# EAGLE design W010X (EAGLE 6.6.0)
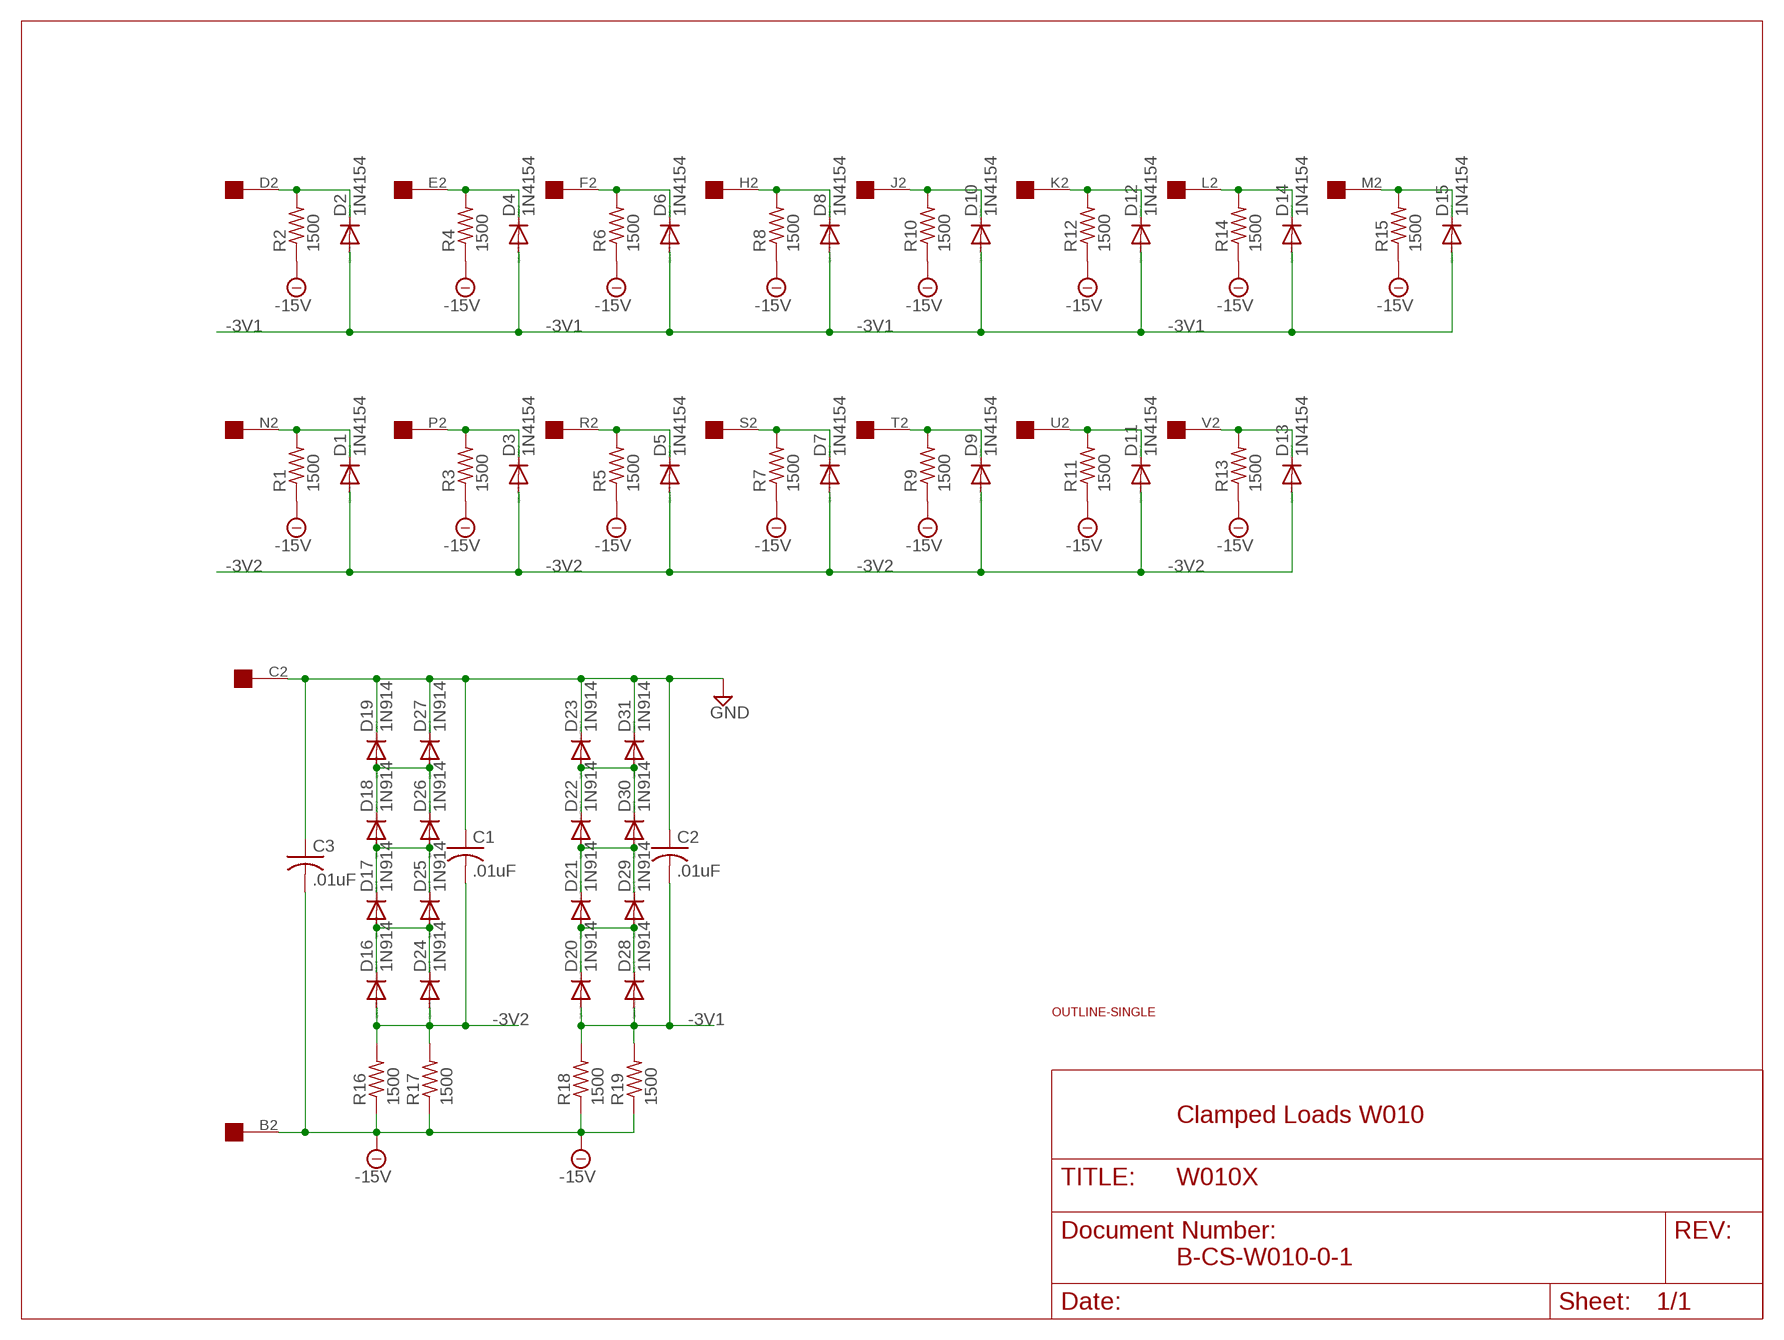
[diagram p0: schematic, sheet 1]

## Parts
C1  .01uF  C-US  [C063-025X075]
C2  .01uF  C-US  [C063-025X075]
C3  .01uF  C-US  [C063-025X075]
D1  1N4154  DIODE-DO35-10  [DO35-10]
D2  1N4154  DIODE-DO35-10  [DO35-10]
D3  1N4154  DIODE-DO35-10  [DO35-10]
D4  1N4154  DIODE-DO35-10  [DO35-10]
D5  1N4154  DIODE-DO35-10  [DO35-10]
D6  1N4154  DIODE-DO35-10  [DO35-10]
D7  1N4154  DIODE-DO35-10  [DO35-10]
D8  1N4154  DIODE-DO35-10  [DO35-10]
D9  1N4154  DIODE-DO35-10  [DO35-10]
D10  1N4154  DIODE-DO35-10  [DO35-10]
D11  1N4154  DIODE-DO35-10  [DO35-10]
D12  1N4154  DIODE-DO35-10  [DO35-10]
D13  1N4154  DIODE-DO35-10  [DO35-10]
D14  1N4154  DIODE-DO35-10  [DO35-10]
D15  1N4154  DIODE-DO35-10  [DO35-10]
D16  1N914  DIODE-DO35-10  [DO35-10]
D17  1N914  DIODE-DO35-10  [DO35-10]
D18  1N914  DIODE-DO35-10  [DO35-10]
D19  1N914  DIODE-DO35-10  [DO35-10]
D20  1N914  DIODE-DO35-10  [DO35-10]
D21  1N914  DIODE-DO35-10  [DO35-10]
D22  1N914  DIODE-DO35-10  [DO35-10]
D23  1N914  DIODE-DO35-10  [DO35-10]
D24  1N914  DIODE-DO35-10  [DO35-10]
D25  1N914  DIODE-DO35-10  [DO35-10]
D26  1N914  DIODE-DO35-10  [DO35-10]
D27  1N914  DIODE-DO35-10  [DO35-10]
D28  1N914  DIODE-DO35-10  [DO35-10]
D29  1N914  DIODE-DO35-10  [DO35-10]
D30  1N914  DIODE-DO35-10  [DO35-10]
D31  1N914  DIODE-DO35-10  [DO35-10]
R1  1500  R-US_0207/10  [0207/10]
R2  1500  R-US_0207/10  [0207/10]
R3  1500  R-US_0207/10  [0207/10]
R4  1500  R-US_0207/10  [0207/10]
R5  1500  R-US_0207/10  [0207/10]
R6  1500  R-US_0207/10  [0207/10]
R7  1500  R-US_0207/10  [0207/10]
R8  1500  R-US_0207/10  [0207/10]
R9  1500  R-US_0207/10  [0207/10]
R10  1500  R-US_0207/10  [0207/10]
R11  1500  R-US_0207/10  [0207/10]
R12  1500  R-US_0207/10  [0207/10]
R13  1500  R-US_0207/10  [0207/10]
R14  1500  R-US_0207/10  [0207/10]
R15  1500  R-US_0207/10  [0207/10]
R16  1500  R-US_0207/10  [0207/10]
R17  1500  R-US_0207/10  [0207/10]
R18  1500  R-US_0207/10  [0207/10]
R19  1500  R-US_0207/10  [0207/10]
U$1  EDGE-1  [EDGE-CON1]
U$2  OUTLINE-SINGLE  [SINGLE]

## Nets
-3V1: C2.2 D2.A D4.A D6.A D8.A D10.A D12.A D14.A D15.A D20.A D28.A R18.2 R19.2
-3V2: C1.2 D1.A D3.A D5.A D7.A D9.A D11.A D13.A D16.A D24.A R16.2 R17.2
-15V: C3.2 R1.1 R2.1 R3.1 R4.1 R5.1 R6.1 R7.1 R8.1 R9.1 R10.1 R11.1 R12.1 R13.1 R14.1 R15.1 R16.1 R17.1 R18.1 R19.1 U$1.B2
GND: C1.1 C2.1 C3.1 D19.C D23.C D27.C D31.C U$1.C2
N$1: D2.C R2.2 U$1.D2
N$2: D4.C R4.2 U$1.E2
N$3: D6.C R6.2 U$1.F2
N$4: D8.C R8.2 U$1.H2
N$5: D10.C R10.2 U$1.J2
N$6: D12.C R12.2 U$1.K2
N$7: D14.C R14.2 U$1.L2
N$8: D15.C R15.2 U$1.M2
N$9: D1.C R1.2 U$1.N2
N$10: D3.C R3.2 U$1.P2
N$11: D5.C R5.2 U$1.R2
N$12: D7.C R7.2 U$1.S2
N$13: D9.C R9.2 U$1.T2
N$14: D11.C R11.2 U$1.U2
N$15: D13.C R13.2 U$1.V2
N$16: D16.C D17.A D24.C D25.A
N$18: D17.C D18.A D25.C D26.A
N$19: D18.C D19.A D26.C D27.A
N$21: D20.C D21.A D28.C D29.A
N$22: D21.C D22.A D29.C D30.A
N$23: D22.C D23.A D30.C D31.A
Unconnected: U$1.A2

## Notes on the sheet
- Clamped Loads W010
- B-CS-W010-0-1

## Library data of the parts
C1-C3 = dec-con:C-US: Capacitors with funky DEC lead spacing.
D1-D31 = diode:DIODE-: DIODE
R1-R19 = rcl:R-US_: RESISTOR, American symbol
U$1 = dec-con:EDGE-1: Single-Sided DEC Edge Connector -- (side 2)
U$2 = dec-con:OUTLINE-*: Board outlines for DEC boards.

## Board
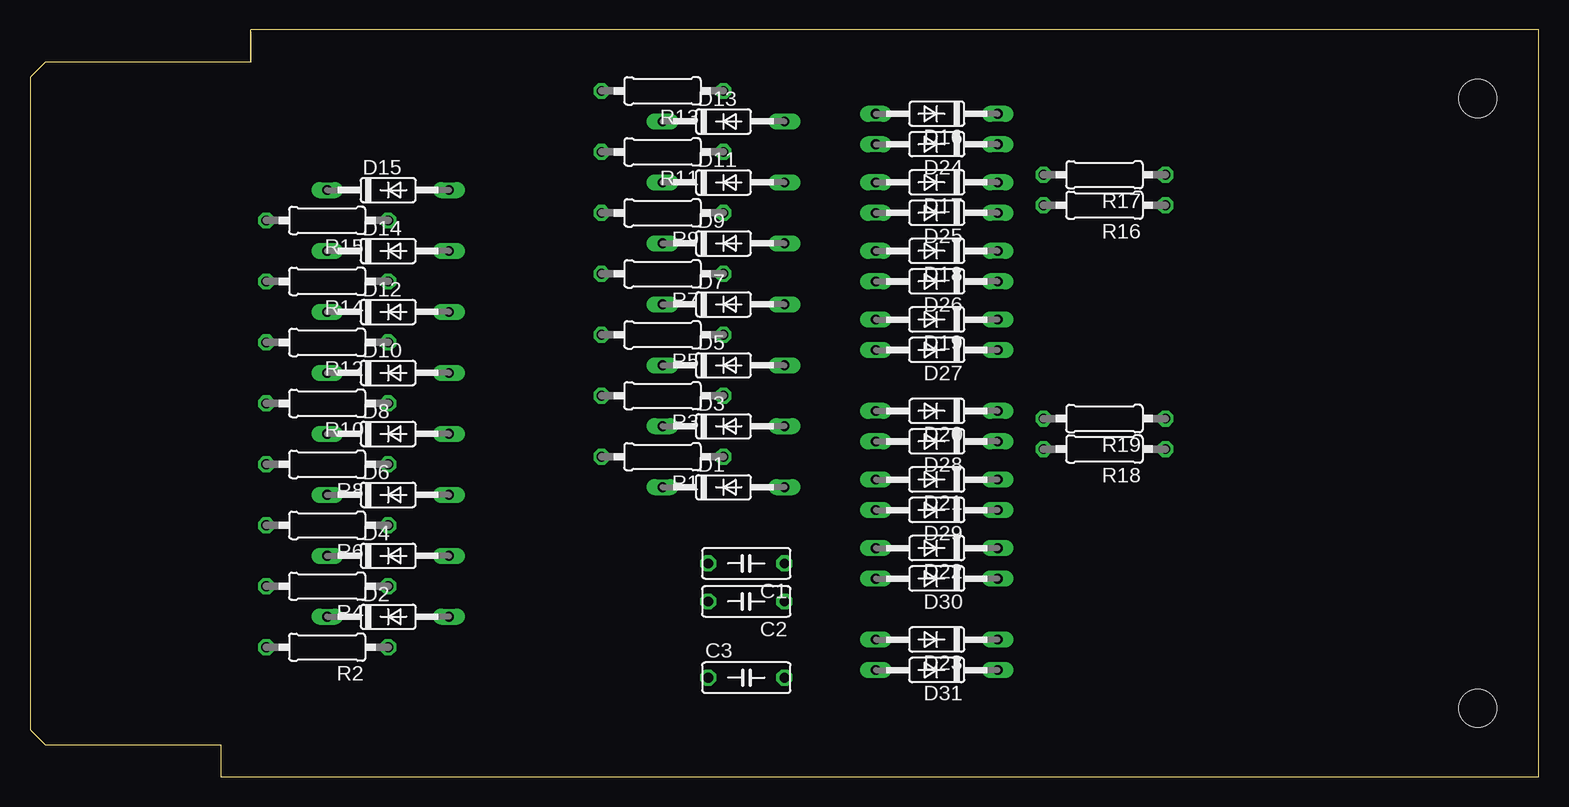
[diagram p1: board, top side]
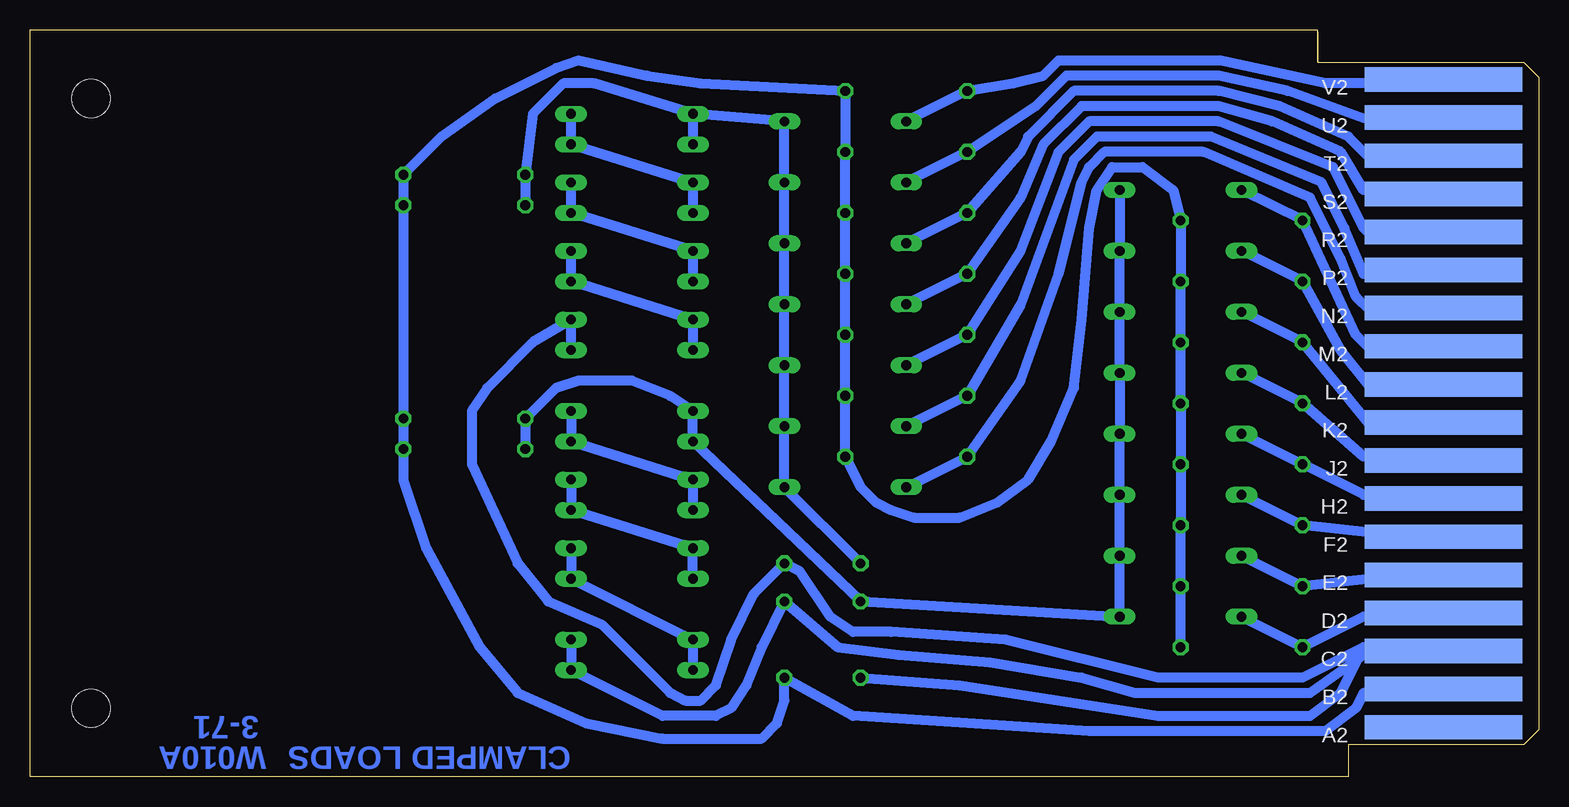
[diagram p2: board, bottom side, seen from below]

Size 125.73 x 62.23 mm. Coordinates in mm from the lower left corner, seen from the top.
Copper layers (1+16): Top 0.035mm / dielectric 1.5mm / Bottom 0.035mm
Design rules "16mils": minimum track width 16mil, minimum drill 32mil, track to track 15mil, track to pad 10mil, pad to pad 10mil, via to via 10mil, smd to smd 10mil, copper to edge 13mil, drill to drill 10mil, minimum pad ring 10mil, minimum via ring 8mil, stop-mask expansion 0mil, vias tented up to drill 0mil, thermal gap 10mil

### Footprints (pad centres in the part's own frame; a part is rotated, then mirrored left to right if it is on the bottom)
C063-025X075 = drill 0.813 octagon: 1 -2.54,0; 2 3.81,0
DO35-10 = drill 0.813 long: A 5.08,0; C -5.08,0
0207/10 = drill 0.813 octagon: 1 -5.08,0; 2 5.08,0
EDGE-CON1 = smd 13.106 x 2.032 bottom: A2 7.938,4.128; B2 7.938,7.303; C2 7.938,10.477; D2 7.938,13.652; E2 7.938,16.828; F2 7.938,20.003; H2 7.938,23.177; J2 7.938,26.352; K2 7.938,29.527; L2 7.938,32.703; M2 7.938,35.877; N2 7.938,39.053; P2 7.938,42.227; R2 7.938,45.403; S2 7.938,48.578; T2 7.938,51.752; U2 7.938,54.928; V2 7.938,58.102
SINGLE = hole 3.175: 120.65,56.515; 120.65,5.715

### Placement (x,y rotation side)
C1  60.33,17.78 180 top
C2  60.33,14.61 180 top
C3  59.06,8.26 0 top
D1  57.79,24.13 0 top
D2  29.85,13.34 0 top
D3  57.79,29.21 0 top
D4  29.85,18.41 0 top
D5  57.79,34.29 0 top
D6  29.85,23.5 0 top
D7  57.79,39.37 0 top
D8  29.85,28.57 0 top
D9  57.79,44.45 0 top
D10  29.85,33.66 0 top
D11  57.79,49.53 0 top
D12  29.85,38.73 0 top
D13  57.79,54.61 0 top
D14  29.85,43.81 0 top
D15  29.85,48.9 0 top
D16  75.57,55.24 180 top
D17  75.57,49.53 180 top
D18  75.57,43.81 180 top
D19  75.57,38.1 180 top
D20  75.57,30.48 180 top
D21  75.57,24.77 180 top
D22  75.57,19.05 180 top
D23  75.57,11.43 180 top
D24  75.57,52.7 180 top
D25  75.57,46.99 180 top
D26  75.57,41.27 180 top
D27  75.57,35.56 180 top
D28  75.57,27.94 180 top
D29  75.57,22.23 180 top
D30  75.57,16.51 180 top
D31  75.57,8.89 180 top
R1  52.71,26.67 180 top
R2  24.77,10.79 180 top
R3  52.71,31.75 180 top
R4  24.77,15.88 180 top
R5  52.71,36.83 180 top
R6  24.77,20.95 180 top
R7  52.71,41.91 180 top
R8  24.77,26.04 180 top
R9  52.71,46.99 180 top
R10  24.77,31.11 180 top
R11  52.71,52.07 180 top
R12  24.77,36.2 180 top
R13  52.71,57.15 180 top
R14  24.77,41.27 180 top
R15  24.77,46.35 180 top
R16  89.54,47.62 180 top
R17  89.54,50.16 180 top
R18  89.54,27.3 180 top
R19  89.54,29.84 180 top
U$1  0,0 0 top
U$2  0,0 0 top

### Tracks (layer width: path | path; a pad name or v marks a point on that pad's centre or on a via)
-3V1
  Bottom 0.813: D15.A D14.A D12.A D10.A D8.A D6.A D4.A D2.A C2.2 D28.A D20.A 72.39,31.75 75.57,33.02 80.01,33.02 81.92,32.38 R19.2 R18.2
-3V2
  Bottom 0.813: C1.2 D1.A D3.A D5.A D7.A D9.A D11.A D13.A D16.A | D16.A 78.74,57.78 81.28,57.78 83.82,55.24 R17.2 R16.2 | D16.A D24.A
-15V
  Bottom 0.813: R2.1 R4.1 R6.1 R8.1 R10.1 R12.1 R14.1 R15.1 30.48,48.9 33.02,50.8 35.56,50.8 36.83,48.9 37.47,45.72 38.1,38.1 38.74,32.38 40.64,27.94 42.55,24.77 45.09,22.86 48.26,21.59 52.07,21.59 53.98,22.23 55.25,22.86 56.52,24.13 R1.1 R3.1 R5.1 R7.1 R9.1 R11.1 R13.1 69.85,57.78 74.3,58.42 80.01,59.69 81.92,59.05 87,56.52 91.44,53.34 R17.1 R16.1 R19.1 R18.1 94.62,24.77 92.71,19.05 88.27,10.79 85.09,6.99 79.38,4.45 73.03,3.17 64.77,3.17 63.5,4.45 62.87,6.35 C3.2 57.15,5.08 37.47,3.81 17.78,3.81 15.24,5.71 14.61,6.99 8.89,6.99 U$1.B2
GND
  Bottom 0.813: D23.C D31.C 73.03,5.08 68.58,5.08 67.31,5.71 66.04,7.62 64.77,10.79 C2.1 58.42,10.79 53.34,10.16 45.72,9.53 38.1,8.26 33.66,6.99 19.05,6.99 14.61,10.16 10.16,10.79 | U$1.C2 8.89,10.79 10.16,10.79 | 10.16,10.79 14.61,10.79 | 14.61,10.79 19.69,8.26 31.75,8.26 44.45,11.43 53.98,12.06 57.15,12.06 59.06,13.34 61.6,17.14 C1.1 65.41,15.24 67.31,11.43 68.58,7.62 69.85,6.35 71.12,6.35 72.39,6.99 78.11,12.7 82.55,14.61 85.09,17.78 88.9,26.04 88.9,30.48 87.63,32.38 83.82,36.2 D19.C D27.C | C3.1 48.26,7.62 31.75,5.08 19.05,5.08 16.51,6.99 14.61,10.79
N$1
  Bottom 0.813: U$1.D2 14.61,13.34 R2.2 D2.C
N$2
  Bottom 0.813: D4.C R4.2 13.97,16.51 10.16,16.51 U$1.E2
N$3
  Bottom 0.813: D6.C R6.2 13.97,20.32 U$1.F2
N$4
  Bottom 0.813: D8.C R8.2 14.61,23.5 U$1.H2
N$5
  Bottom 0.813: U$1.J2 8.89,26.67 14.61,26.67 R10.2 D10.C
N$6
  Bottom 0.813: U$1.K2 8.89,29.21 13.97,29.21 R12.2 D12.C
N$7
  Bottom 0.813: U$1.L2 9.53,32.38 13.97,32.38 16.51,35.56 R14.2 D14.C
N$8
  Bottom 0.813: D15.C R15.2 15.24,36.83 13.97,35.56 8.89,35.56 U$1.M2
N$9
  Bottom 0.813: D1.C R1.2 43.18,33.02 40.01,41.91 38.1,49.53 37.47,50.8 36.2,52.07 27.94,52.07 19.05,48.26 16.51,43.18 15.24,40.01 13.97,38.73 9.53,38.73 U$1.N2
N$10
  Bottom 0.813: D3.C R3.2 43.18,39.37 38.74,51.44 36.83,53.34 27.31,53.34 18.1,49.53 16.19,45.72 14.61,41.91 8.89,41.91 U$1.P2
N$11
  Bottom 0.813: D5.C R5.2 43.18,43.81 40.01,52.07 37.47,54.61 26.67,54.61 17.15,50.8 14.61,45.72 13.97,45.09 10.16,45.09 U$1.R2
N$12
  Bottom 0.813: D7.C R7.2 43.18,48.26 41.28,52.7 38.1,55.88 26.67,55.88 22.23,54.61 16.51,52.07 14.61,48.9 8.89,48.9 U$1.S2
N$13
  Bottom 0.813: D9.C R9.2 43.18,52.07 42.55,53.34 38.74,57.15 26.67,57.15 21.59,55.88 15.88,53.34 13.97,51.44 9.53,51.44 U$1.T2
N$14
  Bottom 0.813: D11.C R11.2 41.91,55.88 39.37,58.42 26.67,58.42 20.96,57.15 13.97,54.61 8.89,54.61 U$1.U2
N$15
  Bottom 0.813: D13.C R13.2 43.82,57.78 41.28,58.42 40.01,59.69 26.67,59.69 17.78,57.78 8.89,57.78 U$1.V2
N$16
  Bottom 0.813: D25.A D17.A D24.C D16.C
N$18
  Bottom 0.813: D26.A D18.A D25.C D17.C
N$19
  Bottom 0.813: D18.C D26.C D19.A D27.A
N$21
  Bottom 0.813: D20.C D28.C D21.A D29.A
N$22
  Bottom 0.813: D21.C D29.C D22.A D30.A
N$23
  Bottom 0.813: D22.C D30.C D23.A D31.A

### Text on the board
Bottom: 3-71 | CLAMPED LOADS | W010A
200bmp: C:/Users/Vince/Documents/eagle/projects/DEC/Wxxx/W010/W010Abackfb.bmp